# Altium schematic sheet Input-Output.SchDoc
size A4; SheetNumber: 3; SheetTotal: 3
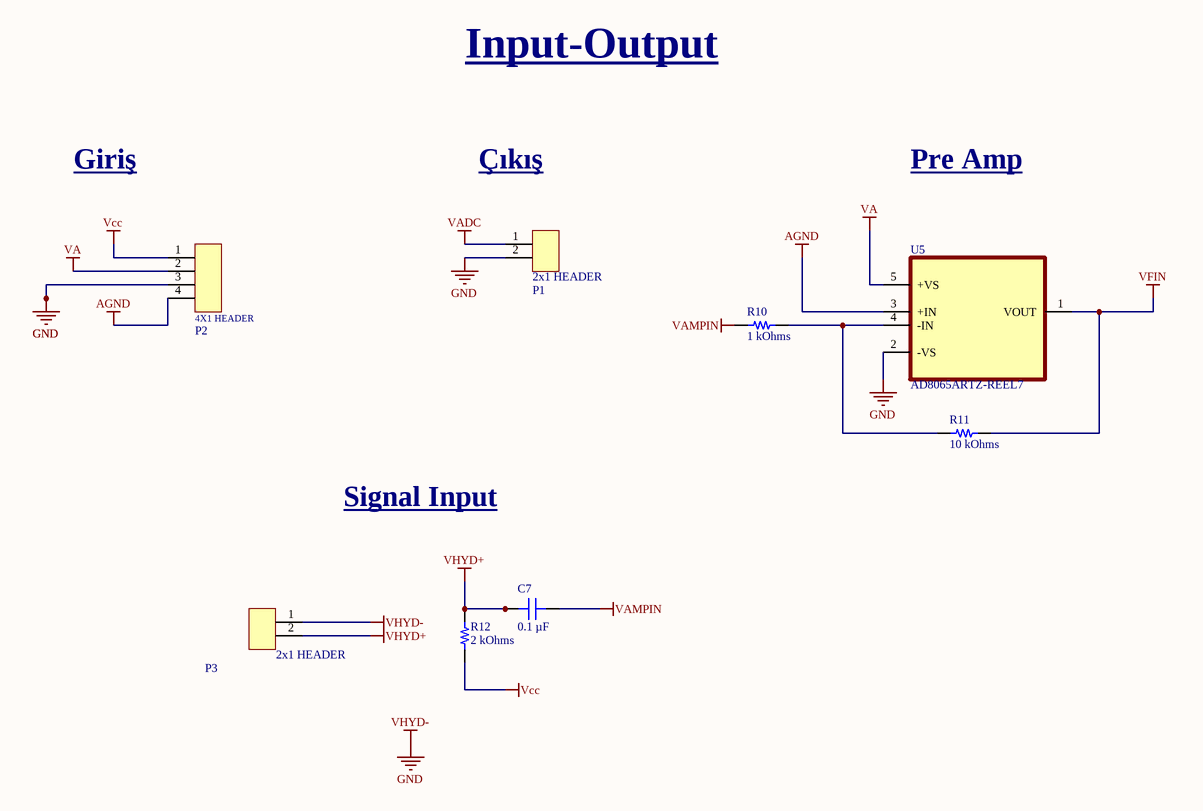
[diagram p0: Input-Output.SchDoc]

## Parts
C7  0.1 µF  [RES 0805_2012]
P1  WIRE-TO BOARD WAFER, 2.5MM, 2 CO  [51025-02-0100-01]  (value not drawn)
P2  WIRE-TO BOARD HEADER, 2.5MM, 4 C  [51125-04-0200-01]  (value not drawn)
P3  WIRE-TO BOARD WAFER, 2.5MM, 2 CO  [51025-02-0100-01]  (value not drawn)
R10  1 kOhms  [RES 1206_3216 RF]
R11  10 kOhms  [RES 1206_3216 RF]
R12  2 kOhms  [RES 1206_3216 RF]
U5  AD8065ARTZ-REEL7  [SOT95P290X145-5N]

## Nets
AGND: P2.4 U5.3(+IN)
GND: P1.2 P2.3 P3.1 U5.2(-VS)  [also labelled VHYD-]
VA: P2.2 U5.5(+VS)
VADC: P1.1
VAMPIN: C7.2 R10.1
Vcc: P2.1 R12.1
VFIN: R11.2 U5.1(VOUT)
VHYD+: C7.1 P3.2 R12.2
NetR10_2: R10.2 R11.1 U5.4(-IN)

## Notes on the sheet
- Input-Output
- Giriş
- Çıkış
- Pre Amp
- Signal Input
- (in symbol 51025-02-0100-01) 2x1 HEADER
- (in symbol 51125-04-0200-01) 4X1 HEADER

## Library data of the parts
C7 = CC0805MRX7R9BB104: CAP CER 0.1UF 50V X7R 0805; manufacturer: Yageo; Tolerance: ±20%; Part Number: CC0805MRX7R9BB104; Value: 0.1 µF; Applications: General Purpose; Capacitance: 0.1 µF; componentlink1description: Datasheet; componentlink1url: https://www.yageo.com/upload/media/product/productsearch/datasheet/mlcc/UPY-GPHC_X7R_6.3V-to-50V_18.pdf; componentlink2description: DigiKey Link; componentlink2url: https://www.digikey.com/en/products/detail/yageo/CC0805MRX7R9BB104/5884281; Device Package: 0805 (2012 Metric); lastupdated: 12.04.2022 22:11:41; Lifecycle Status: Active; Minimum Order: 1; Mounting Type: Surface Mount, MLCC; Operating Temperature: -55°C ~ 125°C; Package / Case: 0805 (2012 Metric); packaging: TapeAndReel; partid: 2475; Part Status: Active; price: 0.02; series: CC; Size / Dimension: 0.079" L x 0.049" W (2.00mm x 1.25mm); Supplier 1: DigiKey; Supplier Part Number 1: 311-4351-1-ND; Temperature Coefficient: X7R; Thickness (Max): 0.037" (0.95mm); Voltage - Rated: 50V
P1 P3 = 51025-02-0100-01: Connector Header Through Hole 2 position 0.098" (2.50mm); Manufacturer: CNC Tech; Supplier 1: Digi-Key; Manufacturer Part Number: 51025-02-0100-01; RoHS: No; Stock 1: 15526; Pricing 1: 1=0,10000, 10=0,08300, 100=0,06090, 500=0,05040, 1000=0,04410, 5000=0,03780, 10000=0,03675 (USD); Supplier Part Number 1: 1175-51025-02-0100-01-ND
P2 = 51125-04-0200-01: Manufacturer: CNC Tech; Supplier 1: Digi-Key; Manufacturer Part Number: 51125-04-0200-01; RoHS: No; Category: Connectors; Stock 1: 5369; Pricing 1: 1=0,21000, 10=0,17700, 100=0,13650, 500=0,11550, 1000=0,09450, 5000=0,08400, 10000=0,07613 (USD); Supplier Part Number 1: 1175-51125-04-0200-01-ND
R10 = CRGH0805J1K0: RES SMD 1K OHM 5% 1/3W 0805; Manufacturer: TE Connectivity Passive Product; Power (Watts): 0.333W, 1/3W; Temperature Coefficient: ±100ppm/°C; Part Number: CRGH0805J1K0; Value: 1 kOhms; ComponentLink1Description: Datasheet; ComponentLink1URL: https://www.te.com/commerce/DocumentDelivery/DDEController?Action=srchrtrv&DocNm=1773204-1&DocType=DS&DocLang=English; ComponentLink2Description: DigiKey Link; ComponentLink2URL: https://www.digikey.com/en/products/detail/te-connectivity-passive-product/CRGH0805J1K0/2385524; Composition: Thick Film; Device Package: 0805 (2012 Metric); LastUpdated: 12.04.2022 22:40:40; Lifecycle Status: Active; Minimum Order: 1; Number of Terminations: 2; Operating Temperature: -55°C ~ 155°C; Package / Case: 0805 (2012 Metric); Packaging: TapeAndReel; PartId: 28125; Part Status: Active; Price: 0.01; Resistance: 1 kOhms; Series: CRGH, Neohm; Size / Dimension: 0.083" L x 0.051" W (2.10mm x 1.30mm); Supplier 1: DigiKey; Supplier Part Number 1: A126435CT-ND; Supplier Device Package: 0805; Tolerance: ±5%
R11 = RNCF0805DTE10K0: RES 10K OHM 0.5% 1/8W 0805; Manufacturer: Stackpole Electronics Inc; Power (Watts): 0.125W, 1/8W; Temperature Coefficient: ±25ppm/°C; Part Number: RNCF0805DTE10K0; Value: 10 kOhms; ComponentLink1Description: Datasheet; ComponentLink1URL: https://www.seielect.com/catalog/sei-rncf.pdf; ComponentLink2Description: DigiKey Link; ComponentLink2URL: https://www.digikey.com/en/products/detail/stackpole-electronics-inc/RNCF0805DTE10K0/1708247; Composition: Thin Film; Device Package: 0805 (2012 Metric); Features: Automotive AEC-Q200; Height - Seated (Max): 0.026" (0.65mm); LastUpdated: 12.04.2022 22:40:40; Lifecycle Status: Active; Minimum Order: 1; Number of Terminations: 2; Operating Temperature: -55°C ~ 155°C; Package / Case: 0805 (2012 Metric); Packaging: TapeAndReel; PartId: 28029; Part Status: Active; Price: 0.01; Ratings: AEC-Q200; Resistance: 10 kOhms; Series: RNCF; Size / Dimension: 0.079" L x 0.049" W (2.00mm x 1.25mm); Supplier 1: DigiKey; Supplier Part Number 1: RNCF0805DTE10K0CT-ND; Supplier Device Package: 0805; Tolerance: ±0.5%
R12 = RCS08052K00FKEA: RES SMD 2K OHM 1% 0.4W 0805; Manufacturer: Vishay Dale; Power (Watts): 0.4W, 2/5W; Temperature Coefficient: ±100ppm/°C; Part Number: RCS08052K00FKEA; Value: 2 kOhms; ComponentLink1Description: Datasheet; ComponentLink1URL: http://www.vishay.com/docs/20065/rcse3.pdf; ComponentLink2Description: DigiKey Link; ComponentLink2URL: https://www.digikey.com/en/products/detail/vishay-dale/RCS08052K00FKEA/5866986; Composition: Thick Film; Device Package: 0805 (2012 Metric); Features: Automotive AEC-Q200, Pulse Withstanding; Height - Seated (Max): 0.020" (0.50mm); LastUpdated: 12.04.2022 22:40:41; Lifecycle Status: Active; Minimum Order: 1; Number of Terminations: 2; Operating Temperature: -55°C ~ 155°C; Package / Case: 0805 (2012 Metric); Packaging: TapeAndReel; PartId: 27786; Part Status: Active; Price: 0.03; Ratings: AEC-Q200; Resistance: 2 kOhms; Series: RCS e3; Size / Dimension: 0.079" L x 0.049" W (2.00mm x 1.25mm); Supplier 1: DigiKey; Supplier Part Number 1: 541-2840-1-ND; Supplier Device Package: 0805; Tolerance: ±1%
U5 = AD8065ARTZ-REEL7: Voltage Feedback Amplifier 1 Circuit Rail-to-Rail SOT-23-5; MF: Analog Devices; Price: None; Package: SOT-23-5 Analog Devices; Value: *; MP: AD8065ARTZ-REEL7; DigiKey-Purchase-URL: https://snapeda.com/shop?store=DigiKey&id=385700; SnapEDA_Link: https://www.snapeda.com/parts/AD8065ARTZ-REEL7/Analog%20Devices%20Inc./view-part/385700/?ref=snap; Availability: Unavailable